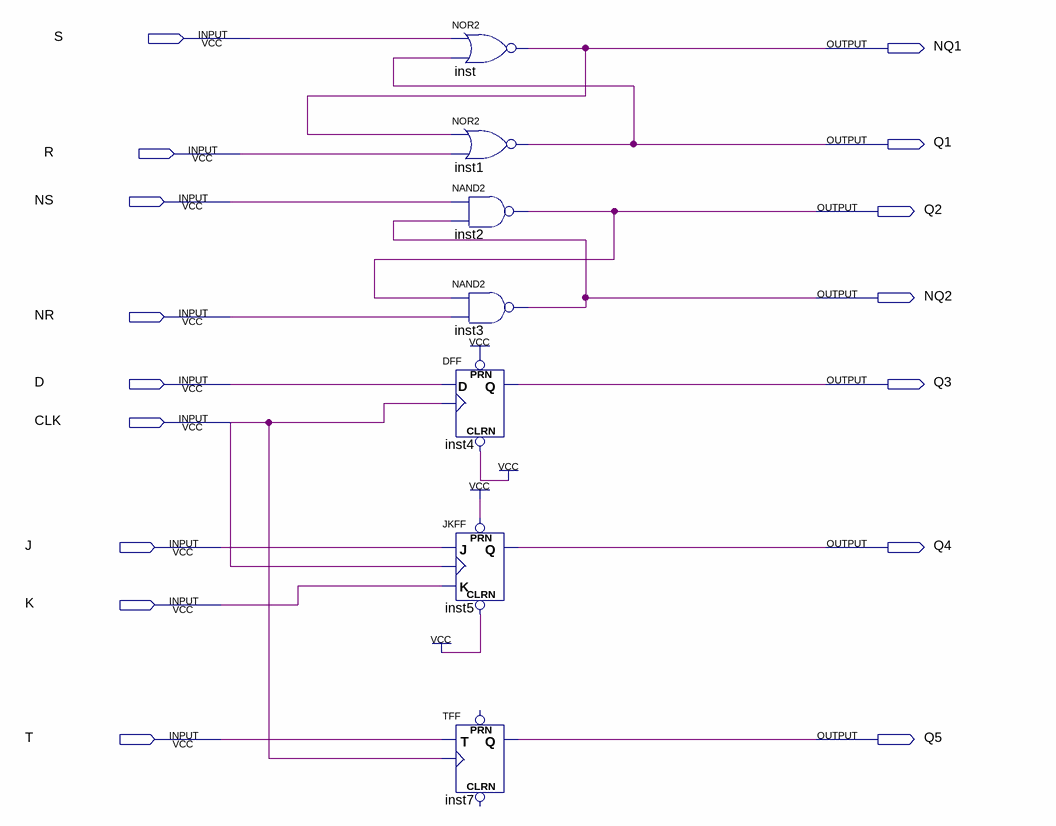
[diagram p0: schematic sheet]
// Quartus schematic lab8.bdf as structural Verilog: 7 symbols, 16 pins
module lab8 (
  input  S,
  input  R,
  input  NS,
  input  NR,
  input  D,
  input  CLK,
  input  J,
  input  K,
  input  T,
  output NQ1,
  output Q1,
  output Q2,
  output NQ2,
  output Q3,
  output Q4,
  output Q5
);

  nor inst (NQ1, S, Q1);
  nor inst1 (Q1, NQ1, R);
  nand inst2 (Q2, NS, NQ2);
  nand inst3 (NQ2, Q2, NR);
  DFF inst4 (.CLRN(1'b1), .CLK(CLK), .D(D), .PRN(1'b1), .Q(Q3));
  JKFF inst5 (.PRN(1'b1), .CLRN(1'b1), .K(K), .J(J), .CLK(CLK), .Q(Q4));
  TFF inst7 (.T(T), .CLK(CLK), .Q(Q5));  // open: PRN, CLRN
endmodule
